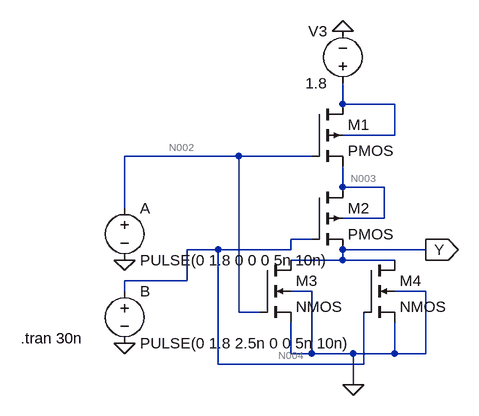
[diagram p0: schematic Cmos_nand.asc]
Cmos_nand.asc, the LTspice schematic file:
Version 4
SHEET 1 880 680
WIRE 288 -16 288 -48
WIRE 368 -16 288 -16
WIRE 368 32 368 -16
WIRE 368 32 288 32
WIRE 128 64 -48 64
WIRE 240 64 128 64
WIRE 288 112 288 80
WIRE 352 112 288 112
WIRE -48 144 -48 64
WIRE 352 160 352 112
WIRE 352 160 288 160
WIRE 240 192 208 192
WIRE 96 208 48 208
WIRE 208 208 208 192
WIRE 208 208 96 208
WIRE 416 208 288 208
WIRE 288 224 288 208
WIRE 288 224 208 224
WIRE 368 224 288 224
WIRE 48 256 48 208
WIRE 48 256 -48 256
WIRE -48 272 -48 256
WIRE 240 272 208 272
WIRE 416 272 368 272
WIRE 128 304 128 64
WIRE 160 304 128 304
WIRE 208 368 208 320
WIRE 240 368 240 272
WIRE 240 368 208 368
WIRE 304 368 240 368
WIRE 368 368 368 320
WIRE 368 368 304 368
WIRE 416 368 416 272
WIRE 416 368 368 368
WIRE 96 384 96 208
WIRE 320 384 320 304
WIRE 320 384 96 384
WIRE 304 416 304 368
FLAG 416 208 Y
IOPIN 416 208 Out
FLAG -48 352 0
FLAG -48 224 0
FLAG 304 416 0
FLAG 288 -128 0
SYMBOL voltage -48 128 R0
SYMATTR InstName A
SYMATTR Value PULSE(0 1.8 0 0 0 5n 10n)
SYMBOL voltage -48 256 R0
SYMATTR InstName B
SYMATTR Value PULSE(0 1.8 2.5n 0 0 5n 10n)
SYMBOL voltage 288 -32 R180
WINDOW 0 24 96 Left 2
WINDOW 3 24 16 Left 2
SYMATTR InstName V3
SYMATTR Value 1.8
SYMBOL pmos4 240 -16 R0
SYMATTR InstName M1
SYMBOL pmos4 240 112 R0
SYMATTR InstName M2
SYMBOL nmos4 160 224 R0
SYMATTR InstName M3
SYMBOL nmos4 320 224 R0
SYMATTR InstName M4
TEXT -208 344 Left 2 !.tran 30n

The netlist it stands for:
* Cmos_nand.asc
V§A N002 0 PULSE(0 1.8 0 0 0 5n 10n)
V§B N004 0 PULSE(0 1.8 2.5n 0 0 5n 10n)
V3 N001 0 1.8
M1 N001 N002 N003 N001 PMOS
M2 N003 N004 Y N003 PMOS
M3 Y N002 0 0 NMOS
M4 Y N004 0 0 NMOS
.model NMOS NMOS
.model PMOS PMOS
.lib standard.mos
.tran 30n
.backanno
.end

* Results of the author's LTspice run, read from the files saved beside the schematic
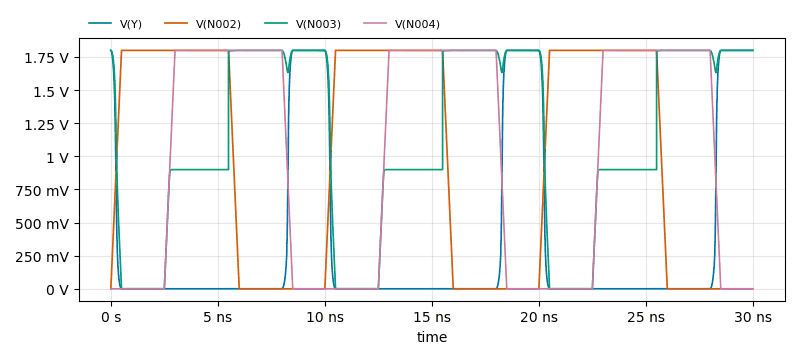
[diagram p1: Transient Analysis of Cmos_nand.asc, plotted from the saved traces]
* Transient Analysis, 1 run:
*   V(Y): min 0 V, max 1.8 V, average 352.7 mV, rms 780.3 mV, last 1.8 V
*   V(N002): min 0 V, max 1.8 V, average 990 mV, rms 1.322 V, last 0 V
*   V(N003): min 600.6 µV, max 1.8 V, average 1.119 V, rms 1.325 V, last 1.8 V
*   V(N004): min 0 V, max 1.8 V, average 990 mV, rms 1.316 V, last 0 V